# Altium schematic sheet p03_display.SchDoc
size A
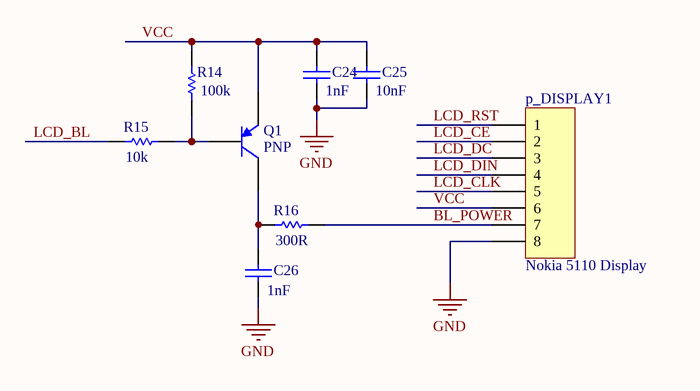
[diagram p0: p03_display.SchDoc]

## Parts
C24  value 1nF  [C0805]  (hidden comment: Cap)
C25  value 10nF  [C0805]  (hidden comment: Cap)
C26  value 1nF  [C0805]  (hidden comment: Cap)
p_DISPLAY1  Nokia 5110 Display  [HDR1X8]
Q1  PNP  [SOT-23B_N]
R14  value 100k  [6-0805_M]  (hidden comment: Res1)
R15  value 10k  [6-0805_M]  (hidden comment: Res1)
R16  value 300R  [6-0805_M]  (hidden comment: Res1)

## Nets
GND: C24.1 C25.1 C26.1 p_DISPLAY1.8
BL_POWER: p_DISPLAY1.7 R16.1
LCD_BL: R15.2
LCD_CE: p_DISPLAY1.2
LCD_CLK: p_DISPLAY1.5
LCD_DC: p_DISPLAY1.3
LCD_DIN: p_DISPLAY1.4
LCD_RST: p_DISPLAY1.1
VCC: C24.2 C25.2 p_DISPLAY1.6 Q1.3(E) R14.1
NetC26_2: C26.2 Q1.1(C) R16.2
NetQ1_2: Q1.2(B) R14.2 R15.1

## Library data of the parts
C24-C26 = Cap: Capacitor; Published: 8-Jun-2000; LatestRevisionDate: 17-Jul-2002; LatestRevisionNote: Re-released for DXP Platform.; PackageReference: RAD-0.3; Publisher: Altium Limited; PackageDescription: Radial Cap, Thru-Hole; 2 Leads; 0.3 in Pin Spacing
p_DISPLAY1 = Header 8: Header, 8-Pin; LatestRevisionDate: 17-Jul-2002; LatestRevisionNote: Re-released for DXP Platform.; Publisher: Altium Limited
Q1 = PNP: PNP Bipolar Transistor; Published: 8-Jun-2000; LatestRevisionDate: 29-May-2009; LatestRevisionNote: IPC-7351 Footprint Added.; PackageVersion: Aug-1999; PackageReference: SOT-23B; Publisher: Altium Limited; PackageDescription: 3-Pin SOT-23 Package 0.95 mm Pitch, 2.4 mm Lead Span
R14-R16 = Res1: Resistor; Published: 8-Jun-2000; LatestRevisionDate: 17-Jul-2002; LatestRevisionNote: Re-released for DXP Platform.; PackageReference: AXIAL-0.3; Publisher: Altium Limited; PackageDescription: Axial Device, Thru-Hole; 2 Leads; 0.3 in Pin Spacing